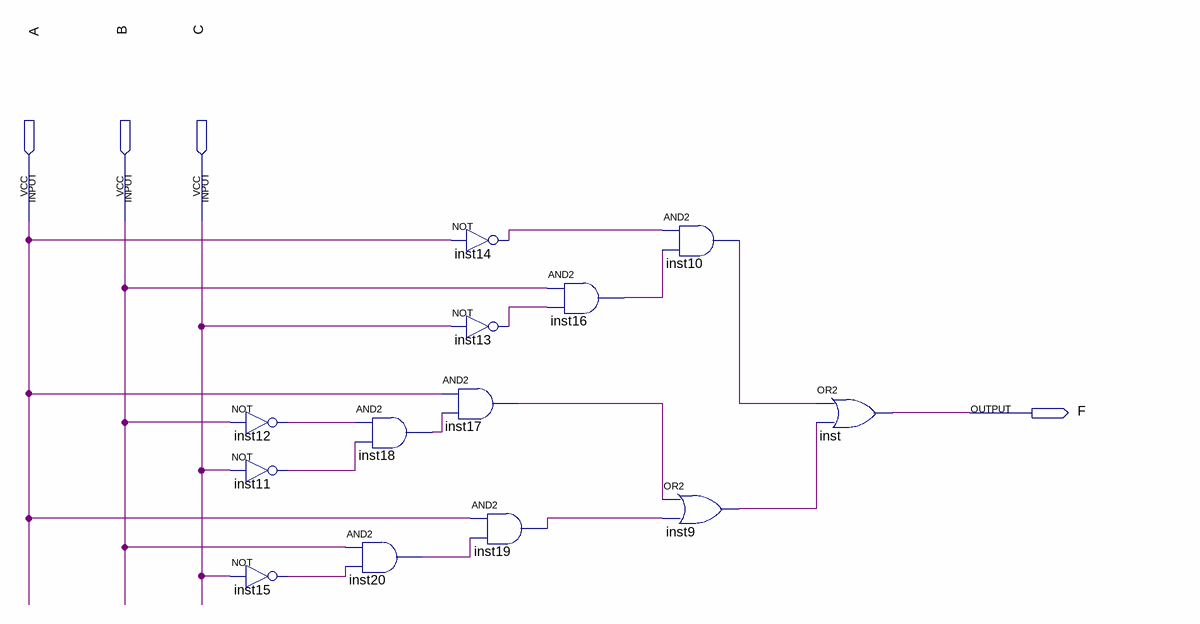
[diagram p0: schematic sheet]
// Quartus schematic lab2step1.bdf as structural Verilog: 13 symbols, 4 pins
module lab2step1 (
  input  A,
  input  B,
  input  C,
  output F
);

  wire inst9_out, inst10_out, inst11_out, inst12_out, inst13_out, inst14_out, inst15_out, inst16_out,
       inst17_out, inst18_out, inst19_out, inst20_out;

  not inst12 (inst12_out, B);
  not inst11 (inst11_out, C);
  not inst15 (inst15_out, C);
  and inst18 (inst18_out, inst12_out, inst11_out);
  and inst20 (inst20_out, B, inst15_out);
  not inst14 (inst14_out, A);
  not inst13 (inst13_out, C);
  and inst17 (inst17_out, A, inst18_out);
  and inst19 (inst19_out, A, inst20_out);
  and inst16 (inst16_out, B, inst13_out);
  and inst10 (inst10_out, inst14_out, inst16_out);
  or inst9 (inst9_out, inst17_out, inst19_out);
  or inst (F, inst10_out, inst9_out);
endmodule
